# Altium schematic sheet TIDA-01576_ADS8686S_AFE_AFE_Pg7-Hardware.SchDoc: Hardware - MIiscellaneous
size 431 x 279 mm; Date: Not shown in title block; ApprovedBy: Not shown in title block; CheckedBy: Not shown in title block; Author: Not shown in title block; CompanyName: Not shown in title block; DrawnBy: Sreenivasa; Engineer: Not shown in title block; Organization: Not shown in title block; Address1: Not shown in title block; Address2: Not shown in title block; Address3: Not shown in title block; Address4: Not shown in title block; DocumentNumber: 1; Revision: Use project parameter SCH_Rev; SheetNumber: 7; SheetTotal: 7; PageSetup: Record=PageOptions|CenterHorizontal=True|CenterVertical=True|PrintScale=1.00|XCorrection=1.00|YCorrection=1.00|PrintKind=0|BorderSize=5000000|LeftOffset=0|BottomOffset=0|Orientation=2|PaperLength=1000|PaperWidth=1000|Scale=100|PaperSource=15|PrintQuality=600|MediaType=1|DitherType=10|PaperKind=Letter|PrintScaleMode=1; CurrentTime: Not shown in title block; CurrentDate: Not shown in title block; Time: Not shown in title block; DocumentFullPathAndName: Not shown in title block; DocumentName: Not shown in title block; ModifiedDate: Not shown in title block; ImagePath: Not shown in title block
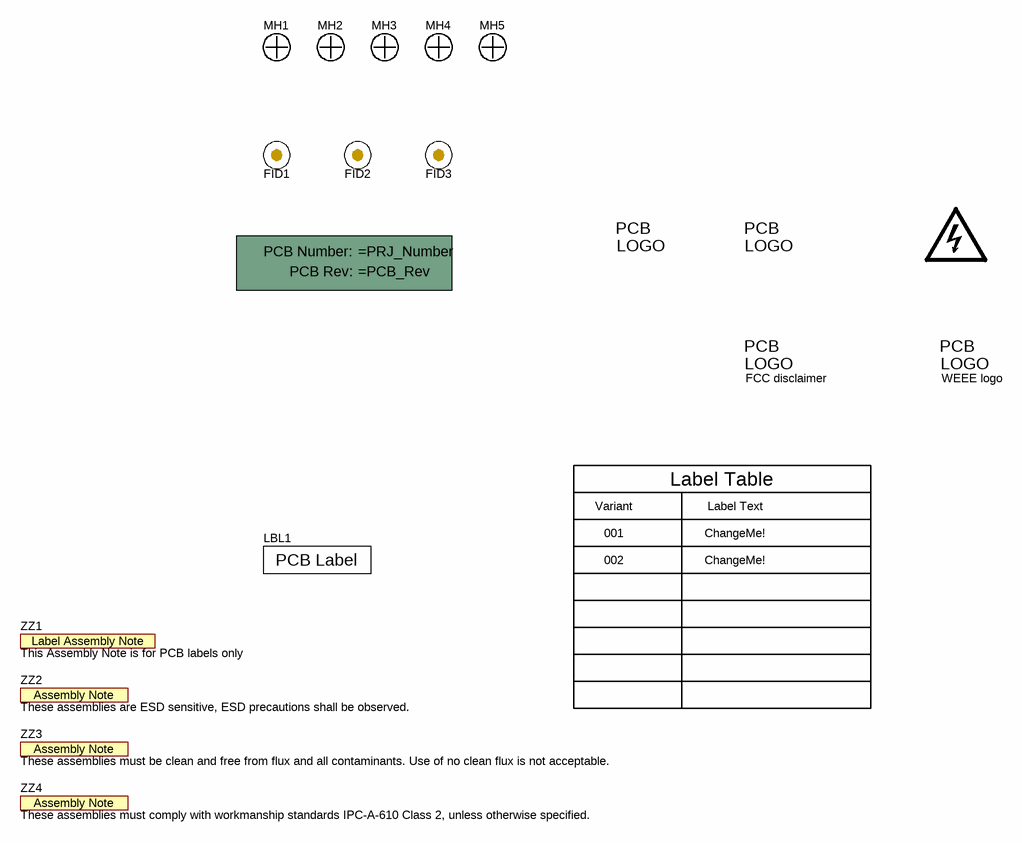
[diagram p0: TIDA-01576_ADS8686S_AFE_AFE_Pg7-Hardware.SchDoc]

## Parts
!PCB1  (no value)  (mechanical)
FID1  (no value)  [Fiducial10-20]
FID2  (no value)  [Fiducial10-20]
FID3  (no value)  [Fiducial10-20]
LBL1  (no value)  [Label_650x200]
Logo1  Pb-Free Symbol  [Pb-Free_Overlay_Small]  (value not drawn)  (no BOM)
Logo3  WEEE logo  [WEEE_Minimum]  (no BOM)
LOGO4  DANGER HIGH VOLTAGE  [IEC_HighVoltage_Small]  (value not drawn)  (no BOM)
Logo5  ESD Susceptible  [ESD_Overlay_small]  (value not drawn)  (no BOM)
Logo6  FCC disclaimer  [FCC_disclaimer]  (no BOM)
MH1  (no value)  [MH3.2]
MH2  (no value)  [MH3.2]
MH3  (no value)  [MH3.2]
MH4  (no value)  [MH3.2]
MH5  (no value)  [MH3.2]
ZZ1  This Assembly Note is for PCB labels only  [AssemblyNoteLabel]  (no BOM)
ZZ2  These assemblies are ESD sensitive, ESD precautions shall be observed.  [AssemblyNote]  (no BOM)
ZZ3  These assemblies must be clean and free from flux and all contaminants. Use of no clean flux is not acceptable.  [AssemblyNote]  (no BOM)
ZZ4  These assemblies must comply with workmanship standards IPC-A-610 Class 2, unless otherwise specified.  [AssemblyNote]  (no BOM)

## Notes on the sheet
- Variant
- 001
- Label Table
- Label Text
- ChangeMe!
- 002
- Drawn By:
- SVN Rev:
- Number:
- TID #:
- Orderable:
- Rev:
- Sheet Title:
- File:
- Project Title:
- Designed for:
- Assembly Variant:
- Mod. Date:
- Sheet:
- Size:
- of
- B
- http://www.ti.com
- Texas Instruments and/or its licensors do not warrant the accuracy or completeness of this specification or any information contained therein. Texas Instruments and/or its licensors do not warrant that this design will meet the specifications, will be suitable for your application or fit for any particular purpose, or will operate in an implementation. Texas Instruments and/or its licensors do not warrant that the design is production worthy. You should completely validate and test your design implementation to confirm the system functionality for your application.
- Engineer:
- Contact:
- © Texas Instruments
- (in symbol AssemblyNote) Assembly Note
- (in symbol AssemblyNoteLabel) Label Assembly Note
- (in symbol CMP-0074769-1) PCB; LOGO
- (in symbol ESD_Susceptible) PCB; LOGO
- (in symbol FCC_disclaimer) PCB; LOGO
- (in symbol Pb-Free) PCB; LOGO
- (in symbol PCB) PCB Number:; PCB Rev:
- (in symbol THT-14-423-10) PCB Label

## Library data of the parts
!PCB1 = PCB: Printed Circuit Board; Manufacturer: Any; SymbolCreator: a0412235; SymbolVersion: 2012-05-30; CompType: PCB; PartNumber: =PRJ_Number; RoHS: O; MountType: N/A; Publisher: Texas Instruments; LatestRevisionDate: 2012-06-27; LatestRevisionNote: Initial Version; Alternate Manufacturer: -; Alternate PartNumber: -
FID1-FID3 = Fiducial: Fiducial mark.  There is nothing to buy or mount.; SymbolCreator: codlsc; SymbolVersion: 2009-11-4; CompType: Fiducial; Publisher: National Semiconductor; LatestRevisionDate: 2011-09-19; LatestRevisionNote: Added Alternate PartNumber and Alternate Manufacturer parameters to appropriate components.; ComponentLink1URL: Paste URL for datasheet here; Manufacturer: N/A; MountType: N/A; PackageReference: Fiducial; PartNumber: N/A; ClassName: FiducialMark
LBL1 = THT-14-423-10: Thermal Transfer Printable Labels, 0.650" W x 0.200" H - 10,000 per roll; Manufacturer: Brady; SymbolCreator: a0412235; CompType: Label; Note: Size: 0.65" x 0.20 "; SymbolVersion: 2012-06-12; ClassName: Label; PartNumber: THT-14-423-10; RoHS: Y; PackageReference: PCB Label 0.650"H x 0.200"W; MountType: N/A; ComponentLink1Description: Web Page; ComponentLink1URL: http://www.bradyid.com/bradyid/pdpv/THT-14-423-10.html; Publisher: Texas Instruments; LatestRevisionDate: 2012-07-31; LatestRevisionNote: Initial Version; Alternate Manufacturer: -; Alternate PartNumber: -; Supplier 1: Farnell; Supplier Part Number 1: 2065596; Supplier 2: Newark; Supplier Part Number 2: 97C5133
Logo1 = Pb-Free: SymbolCreator: a0412235; SymbolVersion: 2011-08-22; Published: 2009-03-03; Publisher: Texas Instruments; LatestRevisionDate: 2016-03-21
Logo3 = CMP-0074769-1: Library Reference: WEEE logo; Lib Reference: WEEE logo; PartNumber: WEEE logo
LOGO4 = IEC_HighVoltage: IEC 61010-1 High Voltage Warning; SymbolCreator: a0412235; SymbolVersion: 2011-08-22; Published: 2009-03-03; Publisher: Texas Instruments; LatestRevisionDate: 2016-03-21
Logo5 = ESD_Susceptible: ESD Susceptible Symbol; SymbolCreator: a0412235; SymbolVersion: 2011-08-22; Published: 2009-03-03; Publisher: Texas Instruments; LatestRevisionDate: 2016-03-21
Logo6 = FCC_disclaimer: SymbolCreator: codlsc; SymbolVersion: 2011-08-22; Published: 2009-03-03; Publisher: Texas Instruments; LatestRevisionDate: 2014-11-20
MH1-MH5 = NY PMS 440 0025 PH: Mountin hole, NPTH Drill 3.2mm; CompType: Hardware; MountType: N/A; RoHS: Y; PackageReference: Screw; ComponentLink1Description: Datasheet Link; ClassName: Mounting Holes; Alternate Manufacturer: -; Alternate PartNumber: -; Publisher: Texas Instruments
ZZ1 = AssemblyNoteLabel: SymbolCreator: a0412235; SymbolVersion: 2012-06-14; CompType: AssemblyNote; ClassName: AssemblyNote; Publisher: Texas Instruments; LatestRevisionDate: 2012-07-31; LatestRevisionNote: Initial Version; Alternate Manufacturer: -; Alternate PartNumber: -
ZZ2-ZZ4 = AssemblyNote: SymbolCreator: codlsc; SymbolVersion: 2010-05-18; CompType: AssemblyNote; ClassName: AssemblyNote; Publisher: Texas Instruments; LatestRevisionDate: 2012-06-14; LatestRevisionNote: Initial Version; Alternate Manufacturer: -; Alternate PartNumber: -